# Altium schematic sheet 03_ZVS_PushPull.SchDoc
size A4; SheetNumber: 3; SheetTotal: 6
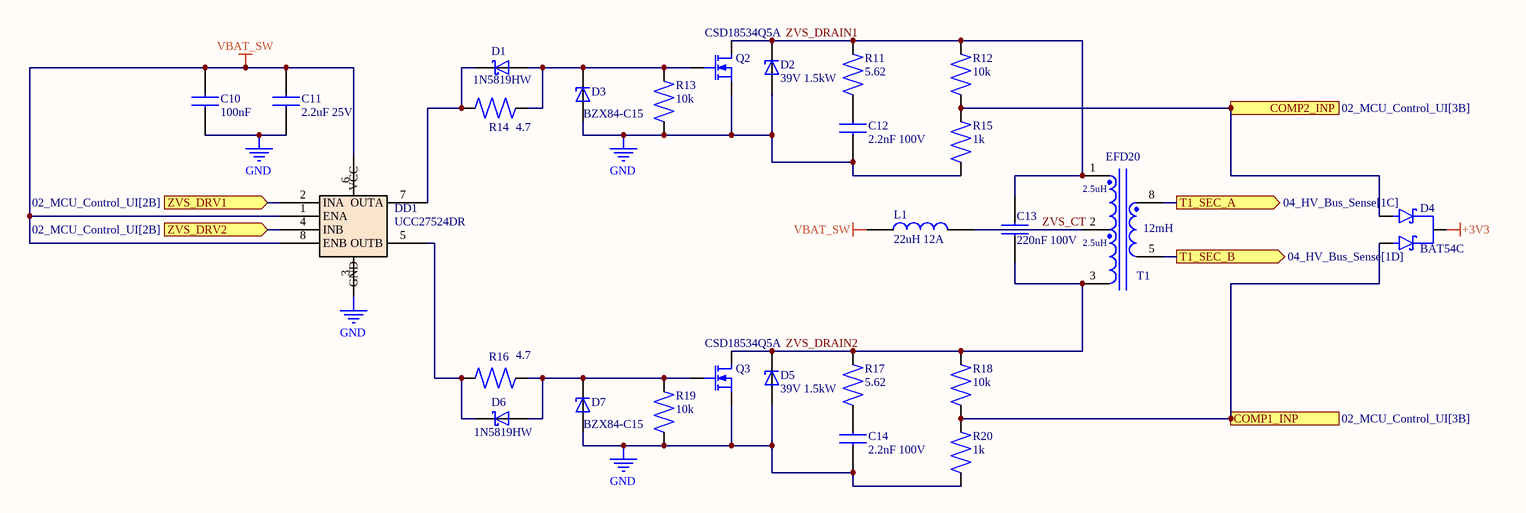
[diagram p0: 03_ZVS_PushPull.SchDoc]

## Parts
C10  100nF  [CHIP_0603_SMD]
C11  2.2uF 25V  [CHIP_0805_SMD]
C12  2.2nF 100V  [CHIP_1206_SMD]
C13  220nF 100V  [CAP_FILM_P15.0_CBB22_W8.5_MKP]
C14  2.2nF 100V  [CHIP_1206_SMD]
D1  1N5819HW  [SOD-123_2P_SMD]
D2  39V 1.5kW  [DIODE_DO-214AB_SMC]
D3  BZX84-C15  [SOT-23_3P_SMD]
D4  BAT54C  [SOT-23_3P_SMD]
D5  39V 1.5kW  [DIODE_DO-214AB_SMC]
D6  1N5819HW  [SOD-123_2P_SMD]
D7  BZX84-C15  [SOT-23_3P_SMD]
DD1  UCC27524DR  [SOIC-8_1.27_4.9x3.9mm]
L1  22uH 12A  [IND_SRP1265A_13.5x12.5_HANDSOLDER]
Q2  CSD18534Q5A  [SON-8_5x6_CSD18534Q5A_THERMAL]
Q3  CSD18534Q5A  [SON-8_5x6_CSD18534Q5A_THERMAL]
R11  5.62  [CHIP_1206_SMD]
R12  10k  [CHIP_0603_SMD]
R13  10k  [CHIP_0603_SMD]
R14  4.7  [CHIP_0603_SMD]
R15  1k  [CHIP_0603_SMD]
R16  4.7  [CHIP_0603_SMD]
R17  5.62  [CHIP_1206_SMD]
R18  10k  [CHIP_0603_SMD]
R19  10k  [CHIP_0603_SMD]
R20  1k  [CHIP_0603_SMD]
T1  EFD20  [TRANS_EFD20_CORETECH_BH-EFD20-1-8R_THT]

## Ports
COMP1_INP (out, see 02_MCU_Control_UI[3B]), COMP2_INP (out, see 02_MCU_Control_UI[3B]), T1_SEC_A (out, see 04_HV_Bus_Sense[1C]), T1_SEC_B (out, see 04_HV_Bus_Sense[1D]), ZVS_DRV1 (in, see 02_MCU_Control_UI[2B]), ZVS_DRV2 (in, see 02_MCU_Control_UI[2B])

## Nets
+3V3: D4.3(K)
GND: C10.1 C11.1 C12.1 C14.1 D2.2(A) D3.1(A) D5.2(A) D7.1(A) DD1.3(GND) Q2.1(SR) Q3.1(SR) R13.1 R15.1 R19.1 R20.1
VBAT_SW: C10.2 C11.2 DD1.1(ENA) DD1.6(VCC) DD1.8(ENB) L1.1
COMP1_INP: D4.2(A2) R18.1 R20.2 ; port COMP1_INP
COMP2_INP: D4.1(A1) R12.1 R15.2 ; port COMP2_INP
T1_SEC_A: T1.8(SEC1) ; port T1_SEC_A
T1_SEC_B: T1.5(SEC2) ; port T1_SEC_B
ZVS_CT: L1.2 T1.2(TAP)
ZVS_DRAIN1: C13.2 D2.1(K) Q2.3(DR) R11.2 R12.2 T1.1(PRI1)
ZVS_DRAIN2: C13.1 D5.1(K) Q3.3(DR) R17.2 R18.2 T1.3(PRI2)
ZVS_DRV1: DD1.2(INA) ; port ZVS_DRV1
ZVS_DRV2: DD1.4(INB) ; port ZVS_DRV2
NetD1_1: D1.1(K) DD1.7(OUTA) R14.1
NetD1_2: D1.2(A) D3.3(K) Q2.2(G) R13.2 R14.2
NetD6_1: D6.1(K) DD1.5(OUTB) R16.1
NetD6_2: D6.2(A) D7.3(K) Q3.2(G) R16.2 R19.2

Not connected (* = marked no-connect by the designer): C12 2; C14 2; R11 1; R17 1

## Notes on the sheet
- (in symbol TRANS_EFD20_CUSTOM) 2.5uH; 12mH

## Library data of the parts
C10 = CAP_0603_100nF_50V_X7R: Capacitor MLCC, Ceramic, 100 nF, 50 V, ±10%, X7R, SMD 0603, Samsung Electro-Mechanics; Part Number:: CL10B104KB8NNNC
C11 = CAP_0805_2.2uF_25V_X7R: Capacitor MLCC, Ceramic, 2.2 uF, 25 V, ±10%, X7R, SMD 0805, Hitano Enterprise
C12 C14 = CAP_1206_2.2nF_100V_C0G: Capacitor MLCC, Ceramic, 2.2 nF, 100 V, ±5%, C0G/NP0, SMD 1206, High Frequency Snubber, Yageo
C13 = CAP_FILM_CBB22_220nF_630V_P15: Capacitor Film, Metallized Polypropylene (MKP/CBB22), 0.22 uF (220 nF), 630 VDC, ±5%, Radial THT, Pitch 15.0mm, ZVS Primary Tank
D1 D6 = DIODE_SCHOTTKY_1N5819HW: Schottky Barrier Diode, 40V, 1A, Vf=0.45V @ 1A, SOD-123
D2 D5 = DIODE_TVS_SMC_1.5SMC39AQ: TVS Diode Unidirectional, 33.3V Vwm, 1500W (10/1000us), DO-214AB (SMC), Automotive Qualified
D3 D7 = DIODE_ZENER_BZX84-C15_SOT23: Zener Diode, 15V, 250mW, ±5%, SOT-23 (TO-236AB), Gate Protection, Nexperia / NXP
D4 = DIODE_ARRAY_BAT54C_SOT23: Dual Schottky Barrier Diode, Common Cathode, 30V, 200mA, Vf=0.32V @ 2mA, SOT-23
DD1 = IC_DRIVER_UCC27524DR: Dual 5A High-Speed Low-Side Gate Driver, 4.5V to 18V VDD, Non-Inverting, SOIC-8, Texas Instruments
L1 = IND_SMD_22uH_12A: Inductor Power Shielded SMD, 22 uH, ±20%, 12A Irms, Ferrite Core, 13.5x12.5x6.2, SRP1265A-220M
Q2 Q3 = MOSFET_N_60V_CSD18534Q5A: MOSFET N-Channel, 60V, 69A, 3.5 mOhm, Logic Level, SON-8 (DFN 5x6), Texas Instruments
R11 R17 = RES_1206_5.62R_1%: Resistor, 5.62 Ohm, ±1%, 0.25W (1/4W), 200V, SMD 1206, Thick Film, Panasonic
R12 R13 R18 R19 = RES_0603_10k_1%: Resistor, 10 kOhm, ±1%, 0.1W (1/10W), 75V, SMD 0603, Thick Film, Hitano
R14 R16 = RES_0603_4R7: Resistor, 4.7 Ohm, ±5%, 0.1W (1/10W), 50V, SMD 0603, Gate Drive Series, KOME
R15 R20 = RES_0603_1k_1%: Resistor, 1 kOhm, ±1%, 0.1W (1/10W), 75V, SMD 0603, Thick Film, Yageo
T1 = TRANS_EFD20_CUSTOM: Custom ZVS Step-Up Transformer, EFD20 Core (N87/PC40), 8-Pin Bobbin, Push-Pull Center-Tapped Primary